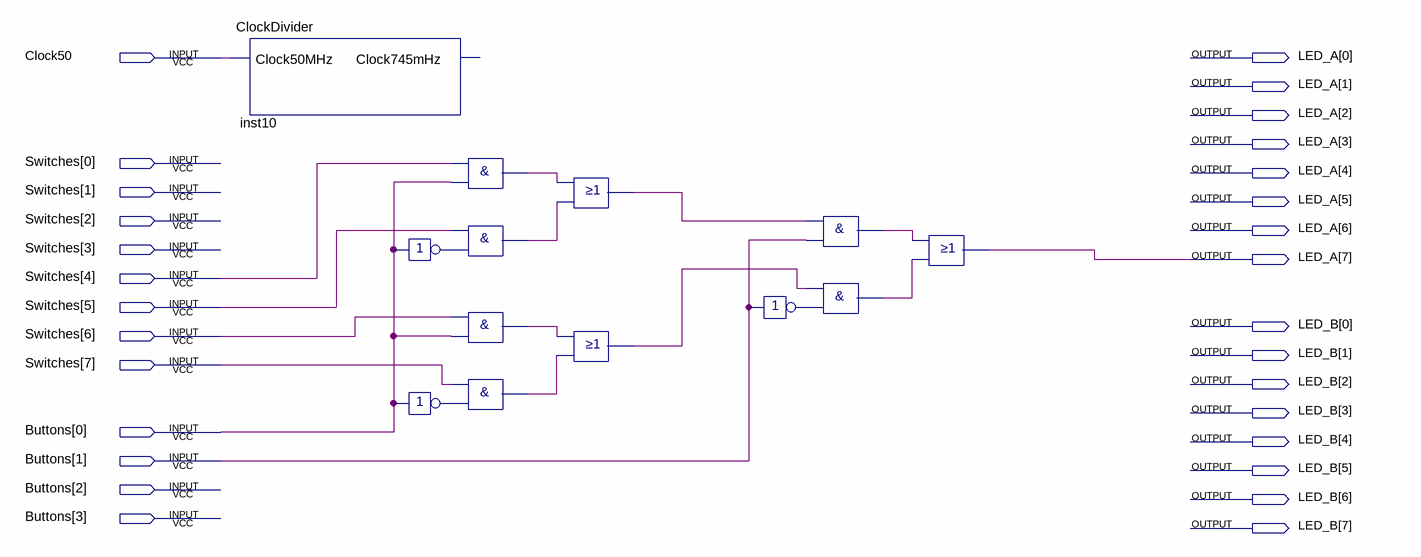
[diagram p0: schematic sheet]
// Quartus schematic 2BitMultiplexer.bdf as structural Verilog: 13 symbols, 29 pins
module \2BitMultiplexer  (
  input  Clock50,
  input  [7:0] Switches,
  input  [3:0] Buttons,
  output [7:0] LED_A,
  output [7:0] LED_B
);

  wire inst1_out, inst2_out, inst3_out, inst4_out, inst5_out, inst7_out, inst8_out, inst9_out, inst12_out,
       inst18_out, inst_out;

  ClockDivider inst10 (.Clock50MHz(Clock50));  // open: Clock745mHz
  not inst (inst_out, Buttons[0]);
  not inst7 (inst7_out, Buttons[0]);
  and inst1 (inst1_out, Switches[4], Buttons[0]);
  and inst2 (inst2_out, Switches[5], inst_out);
  and inst3 (inst3_out, Switches[6], Buttons[0]);
  and inst4 (inst4_out, Switches[7], inst7_out);
  or inst8 (inst8_out, inst1_out, inst2_out);
  or inst12 (inst12_out, inst3_out, inst4_out);
  not inst9 (inst9_out, Buttons[1]);
  and inst5 (inst5_out, inst8_out, Buttons[1]);
  and inst18 (inst18_out, inst12_out, inst9_out);
  or inst13 (LED_A[7], inst5_out, inst18_out);
endmodule
